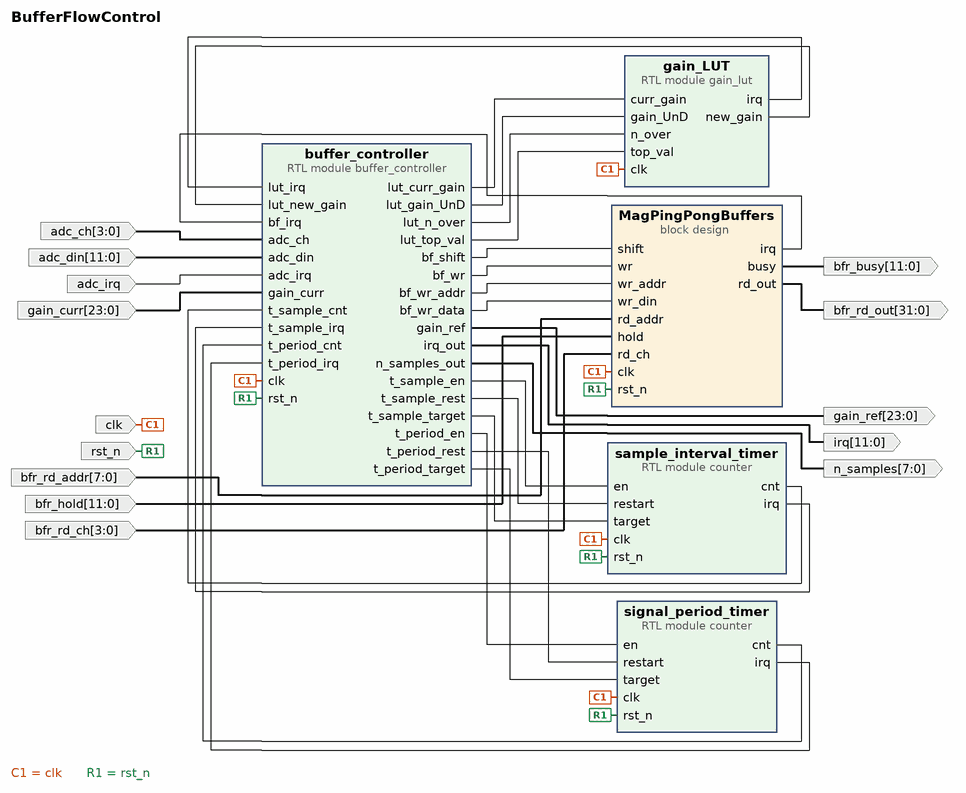
[diagram p0: block diagram of the top level]
# Vivado block design BufferFlowControl, xczu3eg-sbva484-1-i, Vivado 2020.2
create_bd_design BufferFlowControl

create_bd_port -dir I -from 3 -to 0 adc_ch
create_bd_port -dir I -from 11 -to 0 adc_din
create_bd_port -dir I -type intr adc_irq
create_bd_port -dir I -type clk clk
create_bd_port -dir I -from 23 -to 0 gain_curr
create_bd_port -dir O -from 23 -to 0 gain_ref
create_bd_port -dir I -type rst rst_n
create_bd_port -dir I -from 7 -to 0 bfr_rd_addr
create_bd_port -dir I -from 11 -to 0 bfr_hold
create_bd_port -dir I -from 3 -to 0 bfr_rd_ch
create_bd_port -dir O -from 31 -to 0 bfr_rd_out
create_bd_port -dir O -from 11 -to 0 bfr_busy
create_bd_port -dir O -from 11 -to 0 irq
create_bd_port -dir O -from 7 -to 0 n_samples

create_bd_cell -type module -reference counter sample_interval_timer
set_property -dict {CONFIG.auto_rst {"0"} CONFIG.n_bits 20} [get_bd_cells sample_interval_timer]
create_bd_cell -type module -reference counter signal_period_timer
set_property -dict {CONFIG.auto_rst {"0"} CONFIG.n_bits 21} [get_bd_cells signal_period_timer]
create_bd_cell -type container -reference MagPingPongBuffers MagPingPongBuffers
set_property -dict [list \
  CONFIG.ACTIVE_SIM_BD MagPingPongBuffers.bd \
  CONFIG.ACTIVE_SYNTH_BD MagPingPongBuffers.bd \
  CONFIG.ENABLE_DFX 0 \
  CONFIG.LIST_SIM_BD MagPingPongBuffers.bd \
  CONFIG.LIST_SYNTH_BD MagPingPongBuffers.bd \
  CONFIG.LOCK_PROPAGATE 0 \
] [get_bd_cells MagPingPongBuffers]
create_bd_cell -type module -reference gain_lut gain_LUT
create_bd_cell -type module -reference buffer_controller buffer_controller

# ---- connections ----

connect_bd_net [get_bd_pins MagPingPongBuffers/irq] [get_bd_pins buffer_controller/bf_irq]
connect_bd_net [get_bd_ports adc_ch] [get_bd_pins buffer_controller/adc_ch]
connect_bd_net [get_bd_ports adc_din] [get_bd_pins buffer_controller/adc_din]
connect_bd_net [get_bd_ports adc_irq] [get_bd_pins buffer_controller/adc_irq]
connect_bd_net [get_bd_pins buffer_controller/bf_shift] [get_bd_pins MagPingPongBuffers/shift]
connect_bd_net [get_bd_pins buffer_controller/bf_wr] [get_bd_pins MagPingPongBuffers/wr]
connect_bd_net [get_bd_pins buffer_controller/bf_wr_addr] [get_bd_pins MagPingPongBuffers/wr_addr]
connect_bd_net [get_bd_pins buffer_controller/gain_ref] [get_bd_ports gain_ref]
connect_bd_net [get_bd_pins buffer_controller/lut_curr_gain] [get_bd_pins gain_LUT/curr_gain]
connect_bd_net [get_bd_pins buffer_controller/lut_gain_UnD] [get_bd_pins gain_LUT/gain_UnD]
connect_bd_net [get_bd_pins buffer_controller/lut_n_over] [get_bd_pins gain_LUT/n_over]
connect_bd_net [get_bd_pins buffer_controller/lut_top_val] [get_bd_pins gain_LUT/top_val]
connect_bd_net -net buffer_controller_t_sg_prd_en [get_bd_pins buffer_controller/t_period_en] [get_bd_pins signal_period_timer/en]
connect_bd_net -net buffer_controller_t_sg_prd_rest [get_bd_pins buffer_controller/t_period_rest] [get_bd_pins signal_period_timer/restart]
connect_bd_net -net buffer_controller_t_sm_mg_int_en [get_bd_pins buffer_controller/t_sample_en] [get_bd_pins sample_interval_timer/en]
connect_bd_net -net buffer_controller_t_sm_mg_int_rest [get_bd_pins buffer_controller/t_sample_rest] [get_bd_pins sample_interval_timer/restart]
connect_bd_net [get_bd_ports clk] \
  [get_bd_pins sample_interval_timer/clk] [get_bd_pins signal_period_timer/clk] [get_bd_pins MagPingPongBuffers/clk] \
  [get_bd_pins gain_LUT/clk] [get_bd_pins buffer_controller/clk]
connect_bd_net [get_bd_pins gain_LUT/irq] [get_bd_pins buffer_controller/lut_irq]
connect_bd_net [get_bd_pins gain_LUT/new_gain] [get_bd_pins buffer_controller/lut_new_gain]
connect_bd_net [get_bd_ports gain_curr] [get_bd_pins buffer_controller/gain_curr]
connect_bd_net [get_bd_ports rst_n] \
  [get_bd_pins sample_interval_timer/rst_n] [get_bd_pins signal_period_timer/rst_n] [get_bd_pins MagPingPongBuffers/rst_n] \
  [get_bd_pins buffer_controller/rst_n]
connect_bd_net -net sample_mag_interval_timer_cnt [get_bd_pins sample_interval_timer/cnt] [get_bd_pins buffer_controller/t_sample_cnt]
connect_bd_net -net sample_mag_interval_timer_irq [get_bd_pins sample_interval_timer/irq] [get_bd_pins buffer_controller/t_sample_irq]
connect_bd_net [get_bd_pins signal_period_timer/cnt] [get_bd_pins buffer_controller/t_period_cnt]
connect_bd_net [get_bd_pins signal_period_timer/irq] [get_bd_pins buffer_controller/t_period_irq]
connect_bd_net -net wr_din_1 [get_bd_pins buffer_controller/bf_wr_data] [get_bd_pins MagPingPongBuffers/wr_din]
connect_bd_net -net rd_addr_0_1 [get_bd_ports bfr_rd_addr] [get_bd_pins MagPingPongBuffers/rd_addr]
connect_bd_net -net hold_0_1 [get_bd_ports bfr_hold] [get_bd_pins MagPingPongBuffers/hold]
connect_bd_net -net rd_ch_0_1 [get_bd_ports bfr_rd_ch] [get_bd_pins MagPingPongBuffers/rd_ch]
connect_bd_net -net MagPingPongBuffers_0_rd_out [get_bd_pins MagPingPongBuffers/rd_out] [get_bd_ports bfr_rd_out]
connect_bd_net -net MagPingPongBuffers_0_busy [get_bd_pins MagPingPongBuffers/busy] [get_bd_ports bfr_busy]
connect_bd_net [get_bd_pins buffer_controller/t_sample_target] [get_bd_pins sample_interval_timer/target]
connect_bd_net [get_bd_pins buffer_controller/t_period_target] [get_bd_pins signal_period_timer/target]
connect_bd_net [get_bd_pins buffer_controller/irq_out] [get_bd_ports irq]
connect_bd_net [get_bd_pins buffer_controller/n_samples_out] [get_bd_ports n_samples]

validate_bd_design
save_bd_design
